# Altium project MLB_REV1.PrjPcb (part 2 of 3)

## Sheet SD_CARD_WiFi.SchDoc: =DocumentName
size B; SheetNumber: 3; SheetTotal: 8
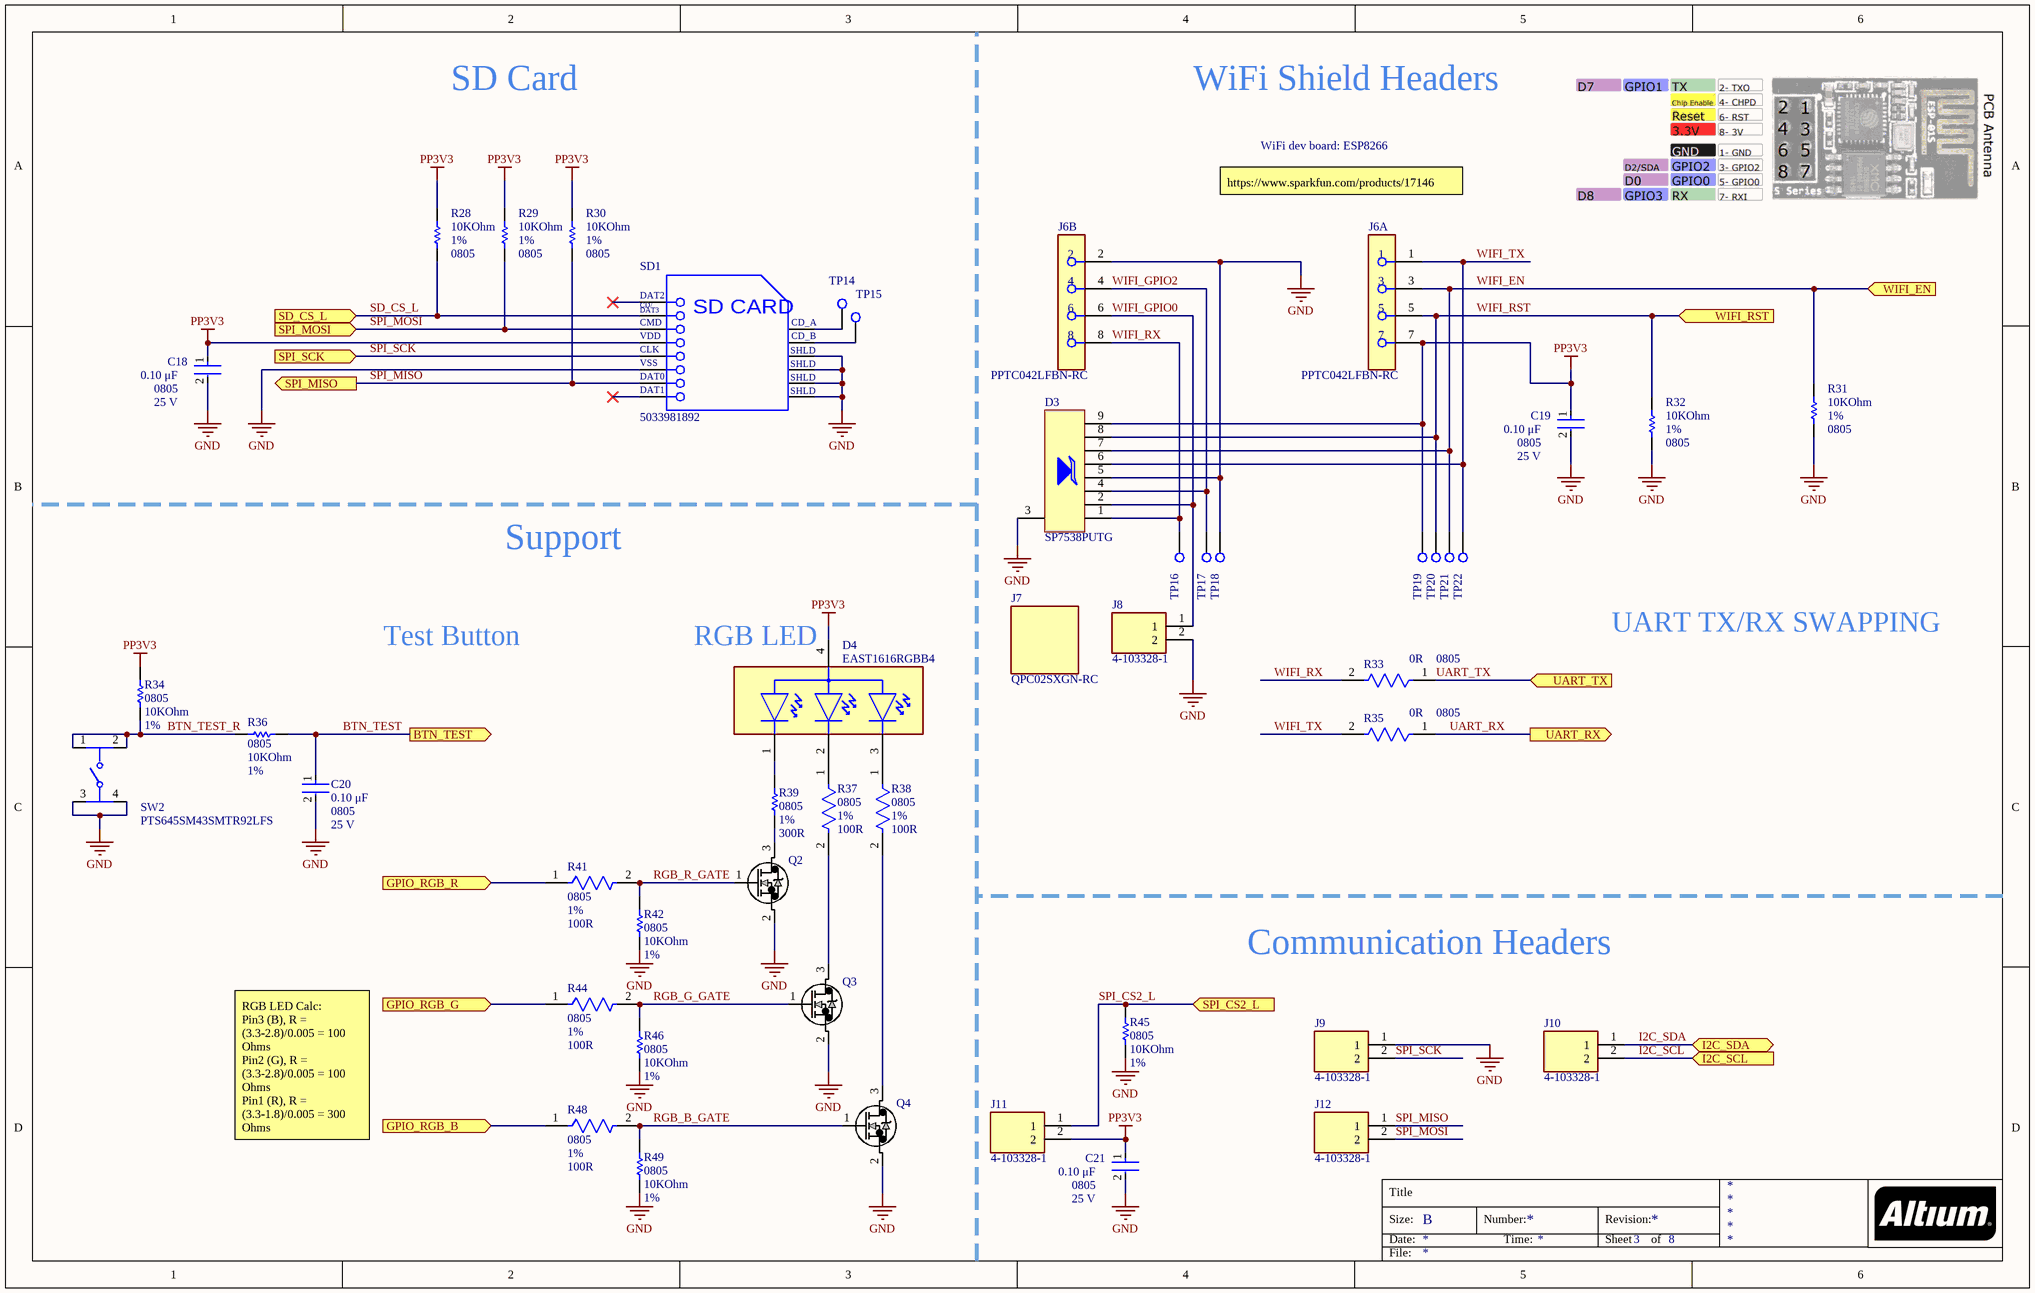
[diagram p2: SD_CARD_WiFi.SchDoc]

### Parts
(Parts that share a designator on the sheet are numbered #1, #2 ... from top to bottom, then left to right.)
C18  Capacitance: 0.10 μF  Package: 0805  Voltage Rating: 25 V  [FP-C0805C-DN-IPC_B]  (hidden comment: C0805C104M3RACTU)
C19  Capacitance: 0.10 μF  Package: 0805  Voltage Rating: 25 V  [FP-C0805C-DN-IPC_B]  (hidden comment: C0805C104M3RACTU)
C20  Capacitance: 0.10 μF  Package: 0805  Voltage Rating: 25 V  [FP-C0805C-DN-IPC_B]  (hidden comment: C0805C104M3RACTU)
C21  Capacitance: 0.10 μF  Package: 0805  Voltage Rating: 25 V  [FP-C0805C-DN-IPC_B]  (hidden comment: C0805C104M3RACTU)
D3  SP7538PUTG  [SP7538PUTG]
D4  EAST1616RGBB4  [FP-EAST1616RGBB4-MFG]
J6  PPTC042LFBN-RC  [FP-PPTC042LFBN-RC-MFG]  (parts A,B of 2)
J7  QPC02SXGN-RC  [FP-QPC02SXGN-RC-MFG]
J8  4-103328-1  [TE_4-103328-1]
J9  4-103328-1  [TE_4-103328-1]
J10  4-103328-1  [TE_4-103328-1]
J11#1  4-103328-1  [TE_4-103328-1]
J12#1  4-103328-1  [TE_4-103328-1]
Q2  RK7002BMT116  [TRANS_RK7002BMHZG_ROM]  (value not drawn)
Q3  RK7002BMT116  [TRANS_RK7002BMHZG_ROM]  (value not drawn)
Q4  RK7002BMT116  [TRANS_RK7002BMHZG_ROM]  (value not drawn)
R28  value 10KOhm  PackageReference: 0805  Tolerance: 1%  [RESC2013X60X35NL10T20]  (hidden comment: RC0805FR-0710KL)
R29  value 10KOhm  PackageReference: 0805  Tolerance: 1%  [RESC2013X60X35NL10T20]  (hidden comment: RC0805FR-0710KL)
R30  value 10KOhm  PackageReference: 0805  Tolerance: 1%  [RESC2013X60X35NL10T20]  (hidden comment: RC0805FR-0710KL)
R31  value 10KOhm  PackageReference: 0805  Tolerance: 1%  [RESC2013X60X35NL10T20]  (hidden comment: RC0805FR-0710KL)
R32  value 10KOhm  PackageReference: 0805  Tolerance: 1%  [RESC2013X60X35NL10T20]  (hidden comment: RC0805FR-0710KL)
R33  Case/Package: 0805  Resistance: 0R  [FP-RMCF0805-MFG]  (hidden comment: RMCF0805ZT0R00)
R34#2  value 10KOhm  PackageReference: 0805  Tolerance: 1%  [RESC2013X60X35NL10T20]  (hidden comment: RC0805FR-0710KL)
R35  Case/Package: 0805  Resistance: 0R  [FP-RMCF0805-MFG]  (hidden comment: RMCF0805ZT0R00)
R36  value 10KOhm  Package Reference: 0805  Tolerance: 1%  [RESC2013X50X30ML20T20]  (hidden comment: CRCW080515K0FKTA)
R37  Case Code (Imperial): 0805  Tolerance: 1%  Resistance: 100R  [FP-RMCF0805-IPC_A]  (hidden comment: RMCF0805FT100R)
R38  Case Code (Imperial): 0805  Tolerance: 1%  Resistance: 100R  [FP-RMCF0805-IPC_A]  (hidden comment: RMCF0805FT100R)
R39  PackageReference: 0805  Tolerance: 1%  Resistance: 300R  [RESC2013X70X40ML20T20]  (hidden comment: ERJ-6ENF3000V)
R41  Case Code (Imperial): 0805  Tolerance: 1%  Resistance: 100R  [FP-RMCF0805-IPC_A]  (hidden comment: RMCF0805FT100R)
R42  value 10KOhm  Package Reference: 0805  Tolerance: 1%  [RESC2013X50X30ML20T20]  (hidden comment: CRCW080515K0FKTA)
R44  Case Code (Imperial): 0805  Tolerance: 1%  Resistance: 100R  [FP-RMCF0805-IPC_A]  (hidden comment: RMCF0805FT100R)
R45  value 10KOhm  Package Reference: 0805  Tolerance: 1%  [RESC2013X50X30ML20T20]  (hidden comment: CRCW080515K0FKTA)
R46  value 10KOhm  Package Reference: 0805  Tolerance: 1%  [RESC2013X50X30ML20T20]  (hidden comment: CRCW080515K0FKTA)
R48  Case Code (Imperial): 0805  Tolerance: 1%  Resistance: 100R  [FP-RMCF0805-IPC_A]  (hidden comment: RMCF0805FT100R)
R49  value 10KOhm  Package Reference: 0805  Tolerance: 1%  [RESC2013X50X30ML20T20]  (hidden comment: CRCW080515K0FKTA)
SD1  5033981892  [MOLX-503398-1892_V]
SW2  PTS645SM43SMTR92LFS  [FP-PTS645SM43SMTR92LFS-MFG]
TP14  RCU-0C  [TP+195X110]  (value not drawn)
TP15#2  RCU-0C  [TP+195X110]  (value not drawn)
TP16  RCU-0C  [TP+195X110]  (value not drawn)
TP17  RCU-0C  [TP+195X110]  (value not drawn)
TP18  RCU-0C  [TP+195X110]  (value not drawn)
TP19  RCU-0C  [TP+195X110]  (value not drawn)
TP20  RCU-0C  [TP+195X110]  (value not drawn)
TP21  RCU-0C  [TP+195X110]  (value not drawn)
TP22  RCU-0C  [TP+195X110]  (value not drawn)

### Ports
BTN_TEST (out), GPIO_RGB_B (in), GPIO_RGB_G (in), GPIO_RGB_R (in), I2C_SCL (in), I2C_SDA (bidir), SD_CS_L (in), SPI_CS2_L (in), SPI_MISO (out), SPI_MOSI (in), SPI_SCK (in), UART_RX (out), UART_TX (in), WIFI_EN (in), WIFI_RST (in)

### Nets
GND: C18.2 C19.2 C20.2 C21.2 D3.3 D3.5 J6.2 J8.2 J9.1 Q2.2 Q3.2 Q4.2 R31.1 R32.1 R42.1 R45.1 R46.1 R49.1 SD1.6(VSS) SD1.11(SHLD) SD1.12(SHLD) SD1.13(SHLD) SD1.14(SHLD) SW2.3 SW2.4 TP18.1
PP3V3: C18.1 C19.1 C21.1 D3.9 D4.4(COMMON_ANODE) J6.7 J11#1.2 R28.2 R29.2 R30.2 R34#2.2 SD1.4(VDD) TP19.1
BTN_TEST: C20.1 R36.2 ; port BTN_TEST
BTN_TEST_R: R34#2.1 R36.1 SW2.1 SW2.2
GPIO_RGB_B: R48.1 ; port GPIO_RGB_B
GPIO_RGB_G: R44.1 ; port GPIO_RGB_G
GPIO_RGB_R: R41.1 ; port GPIO_RGB_R
I2C_SCL: J10.2 ; port I2C_SCL
I2C_SDA: J10.1 ; port I2C_SDA
RGB_B_GATE: Q4.1 R48.2 R49.2
RGB_G_GATE: Q3.1 R44.2 R46.2
RGB_R_GATE: Q2.1 R41.2 R42.2
SD_CS_L: R28.1 SD1.2(CD/DAT3) ; port SD_CS_L
SPI_CS2_L: J11#1.1 R45.2 ; port SPI_CS2_L
SPI_MISO: J12#1.1 R30.1 SD1.7(DAT0) ; port SPI_MISO
SPI_MOSI: J12#1.2 R29.1 SD1.3(CMD) ; port SPI_MOSI
SPI_SCK: J9.2 SD1.5(CLK) ; port SPI_SCK
UART_RX: R35.1 ; port UART_RX
UART_TX: R33.1 ; port UART_TX
WIFI_EN: D3.7 J6.3 R31.2 TP21.1 ; port WIFI_EN
WIFI_GPIO0: D3.2 J6.6 J8.1
WIFI_GPIO2: D3.4 J6.4 TP17.1
WIFI_RST: D3.8 J6.5 R32.2 TP20.1 ; port WIFI_RST
WIFI_RX: D3.1 J6.8 R33.2 TP16.1
WIFI_TX: D3.6 J6.1 R35.2 TP22.1
NetD4_1: D4.1(RED_C) R39.1
NetD4_2: D4.2(GREEN_C) R37.1
NetD4_3: D4.3(BLUE_C) R38.1
NetQ2_3: Q2.3 R39.2
NetQ3_3: Q3.3 R37.2
NetQ4_3: Q4.3 R38.2
NetSD1_9: SD1.9(CD_A) TP14.1
NetSD1_10: SD1.10(CD_B) TP15#2.1

Not connected (* = marked no-connect by the designer): SD1 1(DAT2)* 8(DAT1)*

### Notes on the sheet
- SD Card
- WiFi Shield Headers
- WiFi dev board: ESP8266
- https://www.sparkfun.com/products/17146
- Support
- UART TX/RX SWAPPING
- Test Button
- RGB LED
- Communication Headers
- RGB LED Calc:
  Pin3 (B), R = (3.3-2.8)/0.005 = 100 Ohms
  Pin2 (G), R = (3.3-2.8)/0.005 = 100 Ohms
  Pin1 (R), R = (3.3-1.8)/0.005 = 300 Ohms
- Title
- Size:
- Date:
- B
- Number:
- Time:
- Revision:
- Sheet
- of
- File:
- (in symbol 5033981892) CD/; DAT3; SD CARD

### Library data of the parts
C18-C21 = CMP-2007-00282-2: CAP CER 0.1UF 25V 20% X7R 0805; Manufacturer: KEMET; Temperature Coefficient: 30ppm/°C; Material: Ceramic; Tolerance: 0.2; Value: 0.10 μF; Digikey Description: CAP CER 0.1UF 25V 20% X7R 0805; Device Class L2: Capacitors; Temperature: -55°C to +125°C; Device Class L1: Passive Components; ComponentLink2Description: Datasheet; Mouser Description: Multilayer Ceramic Capacitors MLCC - SMD/SMT 25volts 0.1uF X7R 20%; Temperature Range High: +125°C; Device Class L3: Ceramic Capacitors; Automotive: No; Temperature Range Low: -55°C; RoHS: TRUE; Category: Cap; Lead Free: Yes; Ipc Land Pattern Name: CAPC200125X78; Height: 0.88mm; Temperature Characteristic: X7R; Octopart: https://octopart.com/c0805c104m3ractu-kemet-9138612; ComponentLink2URL: https://content.kemet.com/datasheets/KEM_C1003_C0G_SMD.pdf; Manufacturer Part Number: C0805C104M3RACTU; Supplier: Digi-Key; Supplier Part Number: 399-C0805C104M3RAC7800CT-ND
D3 = SP7538PUTG: ESD Suppressor TVS Octal Uni-Dir 25kV 9-Pin UDFN T/R; Manufacturer: Littelfuse; Number of Unidirectional Channels: 8; Reverse Standoff Voltage: 5V; Clamping Voltage: 7V; Peak Pulse Current: 2A; Power Line Protection: Yes; Supplier: Digi-Key; RoHS: Yes; Category: TVS Diodes; Stock 1: 40273; Pricing 1: 1=0.95000, 10=0.85200, 100=0.66410, 500=0.54862, 1000=0.43838 (USD); Mount: Surface Mount; Number of Pins: 9; Min Operating Temperature: -40°C; Max Operating Temperature: 150°C; Packaging: Cut Tape; RoHS Compliant: Yes; ComponentLink1URL: http://www.littelfuse.com/~/media/electronics/datasheets/tvs_diode_arrays/littelfuse_tvs_diode_array_sp7538p_datasheet.pdf.pdf?src-supplier=Farnell; ComponentLink1Description: http://www.littelfuse.com/~/media/electronics/datasheets/tvs_diode_arrays/littelfuse_tvs_diode_array_sp7538p_datasheet.pdf.pdf?src-supplier=Farnell; ComponentLink2URL: http://www.littelfuse.com/~/media/electronics/datasheets/tvs_diode_arrays/littelfuse_tvs_diode_array_sp7538p_datasheet.pdf.pdf?src-supplier=Digi-Key; ComponentLink2Description: http://www.littelfuse.com/~/media/electronics/datasheets/tvs_diode_arrays/littelfuse_tvs_diode_array_sp7538p_datasheet.pdf.pdf?src-supplier=Digi-Key; ComponentLink3URL: https://www.littelfuse.com/~/media/electronics/datasheets/tvs_diode_arrays/littelfuse_tvs_diode_array_sp7538p_datasheet.pdf.pdf?src-supplier=Digi-Key; ComponentLink3Description: https://www.littelfuse.com/~/media/electronics/datasheets/tvs_diode_arrays/littelfuse_tvs_diode_array_sp7538p_datasheet.pdf.pdf?src-supplier=Digi-Key; ComponentLink4URL: http://www.littelfuse.com/~/media/electronics/datasheets/tvs_diode_arrays/littelfuse_tvs_diode_array_sp7538p_datasheet.pdf.pdf?src-supplier=Arrow+Electronics; ComponentLink4Description: http://www.littelfuse.com/~/media/electronics/datasheets/tvs_diode_arrays/littelfuse_tvs_diode_array_sp7538p_datasheet.pdf.pdf?src-supplier=Arrow+Electronics; ComponentLink5URL: http://www.littelfuse.com/~/media/electronics/datasheets/tvs_diode_arrays/littelfuse_tvs_diode_array_sp7538p_datasheet.pdf.pdf?src-supplier=Mouser; ComponentLink5Description: http://www.littelfuse.com/~/media/electronics/datasheets/tvs_diode_arrays/littelfuse_tvs_diode_array_sp7538p_datasheet.pdf.pdf?src-supplier=Mouser; ComponentLink6URL: http://www.littelfuse.com/~/media/electronics/datasheets/tvs_diode_arrays/littelfuse_tvs_diode_array_sp7538p_datasheet.pdf.pdf?src-supplier=Verical; ComponentLink6Description: http://www.littelfuse.com/~/media/electronics/datasheets/tvs_diode_arrays/littelfuse_tvs_diode_array_sp7538p_datasheet.pdf.pdf?src-supplier=Verical; ComponentLink7URL: http://www.littelfuse.com/~/media/electronics/datasheets/tvs_diode_arrays/littelfuse_tvs_diode_array_sp7538p_datasheet.pdf.pdf?src-supplier=Newark; ComponentLink7Description: http://www.littelfuse.com/~/media/electronics/datasheets/tvs_diode_arrays/littelfuse_tvs_diode_array_sp7538p_datasheet.pdf.pdf?src-supplier=Newark; ComponentLink8URL: http://www.littelfuse.com/~/media/electronics/datasheets/tvs_diode_arrays/littelfuse_tvs_diode_array_sp7538p_datasheet.pdf.pdf?src-supplier=TTI; ComponentLink8Description: http://www.littelfuse.com/~/media/electronics/datasheets/tvs_diode_arrays/littelfuse_tvs_diode_array_sp7538p_datasheet.pdf.pdf?src-supplier=TTI; Supplier Part Number: F7417CT-ND; Manufacturer Part Number: SP7538PUTG
D4 = EAST1616RGBB4: LED RGB CLEAR 4SMD; Manufacturer: Everlight Electronics Co Ltd; Element Configuration: Common Anode; Test Current: 5mA; Lens Color: Colorless; Lens Size: 1.1mm; Viewing Angle: 120°; Color: Blue; Lens Style: Flat; Forward Voltage: 2.8V; Mount: Surface Mount; Length: 1.6mm; Packaging: Tape and Reel; Case/Package: 0606; Lens Transparency: Clear; Case Code (Metric): 1616; Width: 1.6mm; Height: 0.45mm; Case Code (Imperial): 0606; Manufacturer Part Number: EAST1616RGBB4; Supplier: Digi-Key; Supplier Part Number: 1080-1552-1-ND
J6 = PPTC042LFBN-RC: CONN HDR 8POS 0.1 TIN PCB; Manufacturer: Sullins Connector Solutions; Is Female: yes; Conn Orientation: Straight; Conn Gender: Female; Number Of Contacts: 8; Pitch: 2.54mm; Voltage Rating: 250V; Current Rating: 3A; Package: PPTC042LFBN-RC; Number Of Rows: 2; Manufacturer Part Number: PPTC042LFBN-RC; Contact Material: Tin,Nickel; Temperature: -40°C to +105°C; Height: 8.65mm; Device Class L2: Headers and Wire Housings; Octopart: https://octopart.com/pptc042lfbn-rc-sullins-271088; RoHS: TRUE; ComponentLink2URL: https://drawings-pdf.s3.amazonaws.com/10492.pdf; Lead Free: Yes; Automotive: No; Device Class L3: unset; ComponentLink2Description: Datasheet; Temperature Range High: +105°C; Digikey Description: CONN HDR 8POS 0.1 TIN PCB; Category: Conn; Device Class L1: Connectors; Temperature Range Low: -40°C; Supplier: Digi-Key; Supplier Part Number: S7072-ND
J7 = CMP-25666-000001-1: CONN JUMPER SHORTING .100" GOLD; Manufacturer: Sullins; Conn Orientation: Straight; Pitch: 2.54mm; Current Rating: 3A; Number Of Contacts: 2; Category: Conn; Temperature Range Low: -40°C; Temperature Range High: +85°C; Device Class L1: Connectors; Lead Free: Yes; Manufacturer Part Number: QPC02SXGN-RC; Automotive: No; Height: 6.17mm; ComponentLink2URL: https://s3.amazonaws.com/catalogspreads-pdf/PAGE128-129%20.100%20JUMPER.pdf; Device Class L2: unset; Footprint Url: https://drawings-pdf.s3.amazonaws.com/11510.pdf; Device Class L3: unset; Temperature: -40°C to +85°C; RoHS: TRUE; Digikey Description: CONN JUMPER SHORTING .100" GOLD; Octopart: https://octopart.com/qpc02sxgn-rc-sullins-19878795; Package: 0; ComponentLink2Description: Datasheet; Contact Material: Gold; Supplier: Digi-Key; Supplier Part Number: S9337-ND
J8-J10 J11#1 J12#1 = 4-103328-1: Connector Header Through Hole 2 position; Manufacturer: TE Connectivity AMP Connectors; MF: TE Connectivity; SnapEDA_Link: https://www.snapeda.com/parts/4-103328-1/TE%20Connectivity%20AMP%20Connectors/view-part/2384420/?ref=snap; MP: 4-103328-1; TE_purchase_URL: https://www.te.com/usa-en/product-4-103328-1.html?te_bu=Cor&te_type=disp&te_campaign=seda_glo_cor-seda-global-disp-prtnr-fy19-seda-model-bom-cta_sma-317_1&elqCampaignId=32493; Availability: Unavailable; Value: *; EU_RoHS_Compliance: Compliant; Price: None; Package: None; Supplier: Digi-Key; Supplier Part Number: A121364-ND; Manufacturer Part Number: 4-103328-1
Q2-Q4 = RK7002BMT116: No Description Available; Mfr_Name: ROHM Semiconductor; Type: DEV; Copyright: Copyright (C) 2022 Ultra Librarian. All rights reserved.; Digi-Key_Part_Number_1: RK7002BMT116CT-ND; Digi-Key_Part_Number_2: RK7002BMT116DKR-ND; Digi-Key_Part_Number_3: RK7002BMT116TR-ND; RefDes: RefDes; Manufacturer_Part_Number: RK7002BMT116; Manufacturer: Rohm Semiconductor; Manufacturer Part Number: RK7002BMT116; Supplier: Digi-Key; Supplier Part Number: RK7002BMT116CT-ND
R28-R32 R34#2 = CMP-1659-00013-4: Chip Resistor, 10 KOhm, +/- 1%, 0.125 W, -55 to 155 degC, 0805 (2012 Metric), RoHS, Tape and Reel; Manufacturer: Yageo; Voltage Rating: 150 V; Mount: Surface Mount; ComponentLink1Description: Manufacturer URL; ComponentLink2URL: http://www.yageo.com/documents/recent/PYu-RC_Group_51_RoHS_L_04.pdf; Pins: 2; Length: 2 mm; Min Operating Temperature: -55 degC; Height: 0.5 mm; Mounting Technology: Surface Mount; RoHSCompliant: true; REACH SVHC: No SVHC; ComponentLink1URL: http://www.yageo.com/; Max Operating Temperature: 155 degC; DatasheetVersion: Rev. 4, 02/2016; Package Quantity: 5000; Packaging: Tape and Reel; ComponentLink2Description: Datasheet; PackageDescription: 2-Pin Surface Mounted Device, Body 2 x 1.25 mm; Manufacturer Part Number: RC0805FR-0710KL; Supplier: Digi-Key; Supplier Part Number: RC0805FR-0710KL
R33 R35 = CMP-26527-000017-1: RES 0 OHM JUMPER 1/8W 0805; Manufacturer: Stackpole Electronics Inc; Power Rating: 125mW; Depth: 1.25mm; Length: 2mm; Military Standard: Not; Width: 0.049inch; Case Code (Imperial): 0805; Number of Terminations: 2; Mount: Surface Mount; Contact Plating: Tin; Height: 0.026inch; Min Operating Temperature: -55°C; Composition: Thick Film; Max Operating Temperature: 155°C; Packaging: Tape and Reel; Features: Automotive AEC-Q200; Max Power Dissipation: 125mW; Radiation Hardening: No; Lead Free: Lead Free; Case Code (Metric): 2012; Supplier: Digi-Key; Supplier Part Number: RMCF0805ZT0R00CT-ND; Manufacturer Part Number: RMCF0805ZT0R00
R36 R42 R45 R46 R49 = CMP-2001-04968-1: Manufacturer: Vishay Dale; Manufacturer Part Number: CRCW080515K0FKTA; Supplier: Digi-Key; Supplier Part Number: 541-3019-1-ND
R37 R38 R41 R44 R48 = CMP-26527-001731-1: 100Ω ±1% 0.125W 0805 Thick Film Chip Resistor AEC-Q200 compliant; Manufacturer: Stackpole Electronics Inc; Power Rating: 250mW; Temperature Coefficient: 100ppm/°C; Max Power Dissipation: 125mW; Radiation Hardening: No; RoHS Compliant: Yes; Depth: 1.25mm; Length: 2mm; Min Operating Temperature: -55°C; Series: RMCF; Packaging: Tape and Reel; Features: Automotive AEC-Q200; Height: 0.026inch; Size Code: 0805; Number of Terminations: 2; Max Operating Temperature: 155°C; Case/Package: 0805; Width: 0.049inch; Contact Plating: Tin; Resistor Type: Thick Film; Construction: Rectangular; Lead Free: Lead Free; Military Standard: Not; Case Code (Metric): 2012; Mount: Surface Mount; Manufacturer Part Number: RMCF0805FT100R; Supplier: Digi-Key; Supplier Part Number: RMCF0805FT100RCT-ND
R39 = CMP-2001-00110-5: Chip Resistor, 300 Ohm, +/- 1%, 0.125 W, -55 to 155 degC, 0805 (2012 Metric), RoHS, Tape and Reel; Manufacturer: Panasonic; Voltage Rating: 150 V; Package Quantity: 5000; PackageDescription: 2-Pin Surface Mount Device, Body 2 x 1.25 mm; Mounting Technology: Surface Mount; ComponentLink2URL: http://industrial.panasonic.com/cdbs/www-data/pdf/RDA0000/AOA0000C86.pdf; DatasheetVersion: 04/2015; ComponentLink1URL: http://www.panasonic.com/; Mount: Surface Mount; ComponentLink1Description: Manufacturer URL; RoHSCompliant: true; Min Operating Temperature: -55 degC; Height: 0.6 mm; ComponentLink2Description: Datasheet; Max Operating Temperature: 155 degC; Length: 2 mm; Packaging: Tape and Reel; REACH SVHC: Yes; Manufacturer Part Number: ERJ-6ENF3000V; Supplier: Digi-Key; Supplier Part Number: P300CCT-ND
SD1 = 5033981892: Micro SD Connector, Pitch 1.1 mm, 8 Position, Height 1.4 mm, -25 to 85 degC, RoHS, Tape and Reel; Manufacturer: Molex; Voltage Rating: 10VAC/DC; Current Rating: 500mA; Manufacturer URL: http://www.molex.com/; Package Reference: 503398-1892; Packaging: Reel; RoHS: Details; Brand: Molex; Datasheet URL: http://www.molex.com/pdm_docs/sd/5033981892_sd.pdf; Mounting Technology: SurfaceMount; Factory Pack Quantity: 2400; Datasheet Version: Rev. E, 04/2006; Series: 503398; Product Category: MemoryCardConnectors; Package Description: Micro SD Connector, Pitch 1.1 mm, 8 Position, Height 1.4 mm; Supplier: Digi-Key; Supplier Part Number: WM11190CT-ND; Manufacturer Part Number: 5033981892
SW2 = PTS645SM43SMTR92_LFS: SWITCH TACTILE SPST-NO 0.05A 12V; Manufacturer: C&K; Contact Resistance: 100mR; Throw Configuration: SPST; Illumination Type: Non-Illuminated; Mechanical Life: 100000Cycles; Current Rating: 50mA; Switch Function: Off-Mom; Actuator Length: 0.85mm; Actuator Material: Nylon; Actuator Type: Standard; Operating Force: 160gf; Min Operating Temperature: -20°C; REACH SVHC: No SVHC; Termination: Gull Wing; Case/Package: SMD/SMT; Packaging: Tape and Reel; Mount: Surface Mount; Voltage Rating (DC): 12V; Orientation: Straight; Lead Free: Lead Free; Contact Material: Silver; Color: Black; Max Current Rating: 50mA; Contact Plating: Silver; Depth: 9mm; Package Quantity: 1; Max Voltage Rating (DC): 12V; Length: 6mm; Max Operating Temperature: 60°C; Manufacturer Part Number: PTS645SM43SMTR92 LFS; Supplier: Digi-Key; Supplier Part Number: CKN9112CT-ND
TP14 TP15#2 TP16-TP22 = RCU-0C: Natural PC Test Point , Plating Surface Mount Mounting Type; Manufacturer: TE Connectivity AMP Connectors; Value: *; Package: SON-6 TE Connectivity AMP Connectors; Purchase-URL: https://pricing.snapeda.com/search/part/RCU-0C/?ref=eda; Supplier Part Number: A106145CT-ND; Check_prices: https://www.snapeda.com/parts/RCU-0C/TE%20Connectivity/view-part/4791537/?ref=eda; Manufacturer Part Number: RCU-0C; SnapEDA_Link: https://www.snapeda.com/parts/RCU-0C/TE%20Connectivity/view-part/4791537/?ref=snap; Supplier: Digi-Key

## Sheet POWER_MUXES.SchDoc: =DocumentName
size C; SheetNumber: 4; SheetTotal: 8
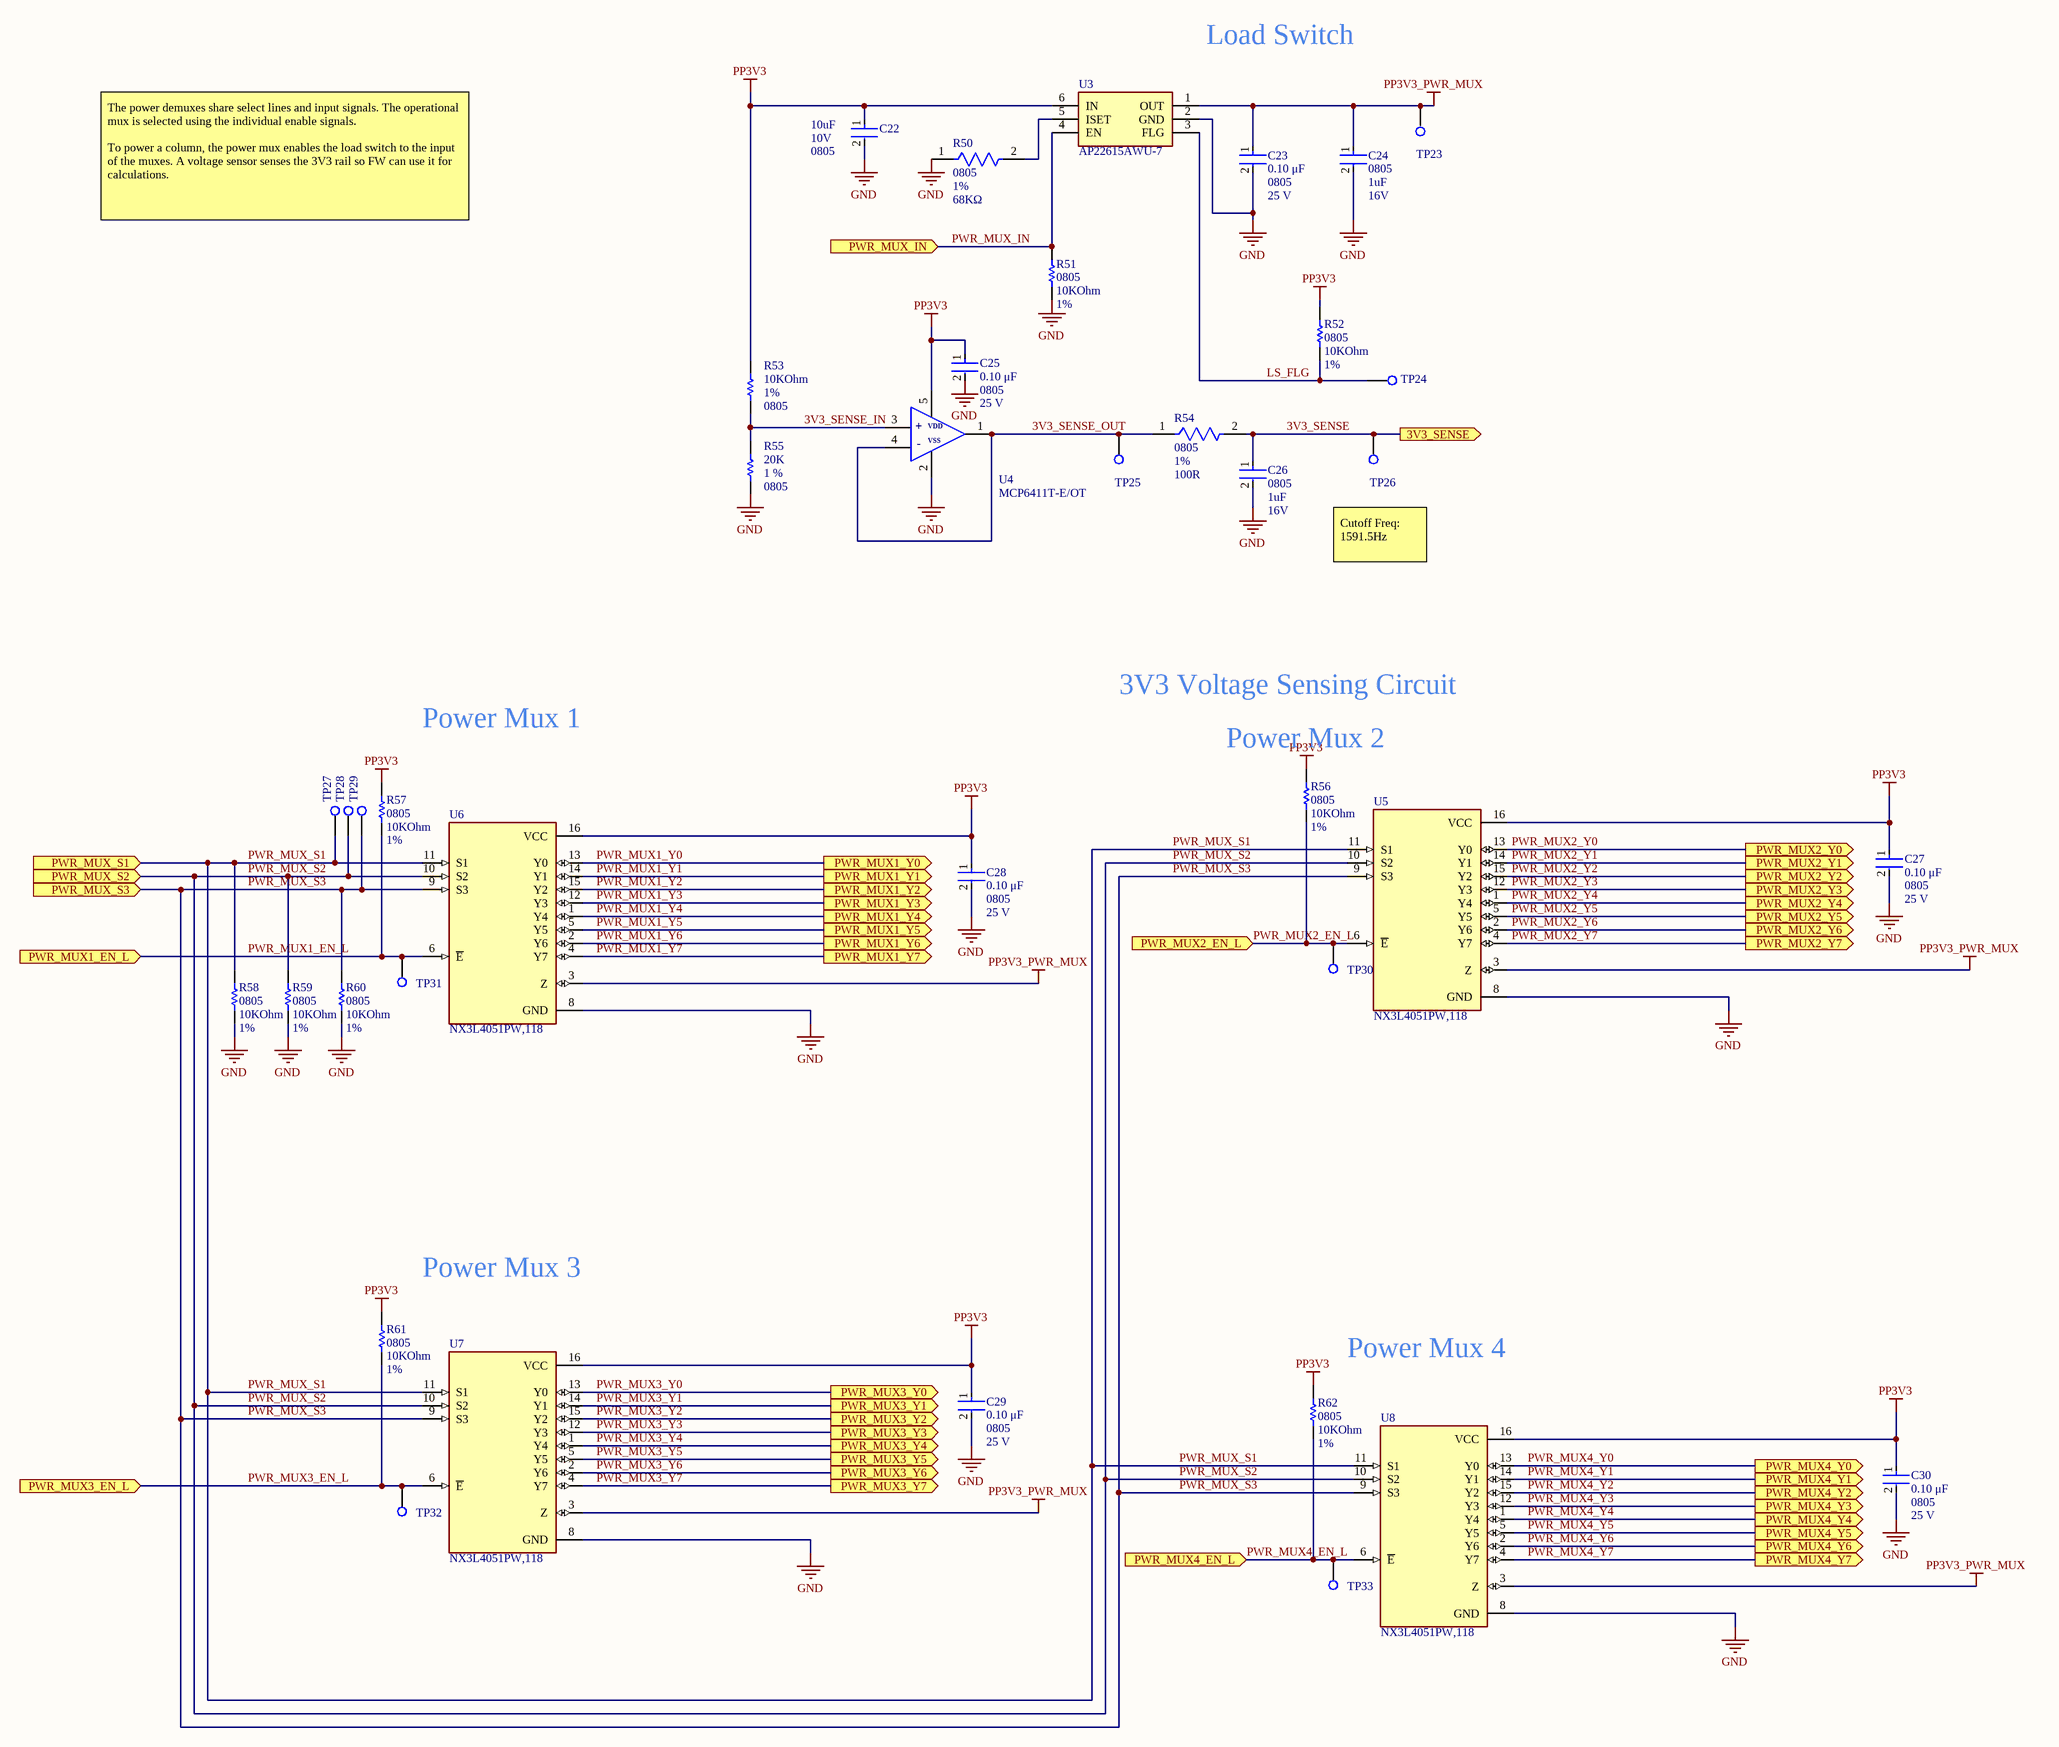
[diagram p3: POWER_MUXES.SchDoc]

### Parts
(Parts that share a designator on the sheet are numbered #1, #2 ... from top to bottom, then left to right.)
C22  Case/Package: 0805  Voltage Rating (DC): 10V  Capacitance: 10uF  [FP-GRM21B-0_15-IPC_A]  (hidden comment: GRM21BR71A106KA73K)
C23  Capacitance: 0.10 μF  Package: 0805  Voltage Rating: 25 V  [FP-C0805C-DN-IPC_B]  (hidden comment: C0805C104M3RACTU)
C24  Case/Package: 0805  Capacitance: 1uF  Voltage: 16V  [FP-CL21-IPC_A]  (hidden comment: CL21B105KOFNNNE)
C25  Capacitance: 0.10 μF  Package: 0805  Voltage Rating: 25 V  [FP-C0805C-DN-IPC_B]  (hidden comment: C0805C104M3RACTU)
C26  Case/Package: 0805  Capacitance: 1uF  Voltage: 16V  [FP-CL21-IPC_A]  (hidden comment: CL21B105KOFNNNE)
C27  Capacitance: 0.10 μF  Package: 0805  Voltage Rating: 25 V  [FP-C0805C-DN-IPC_B]  (hidden comment: C0805C104M3RACTU)
C28  Capacitance: 0.10 μF  Package: 0805  Voltage Rating: 25 V  [FP-C0805C-DN-IPC_B]  (hidden comment: C0805C104M3RACTU)
C29  Capacitance: 0.10 μF  Package: 0805  Voltage Rating: 25 V  [FP-C0805C-DN-IPC_B]  (hidden comment: C0805C104M3RACTU)
C30  Capacitance: 0.10 μF  Package: 0805  Voltage Rating: 25 V  [FP-C0805C-DN-IPC_B]  (hidden comment: C0805C104M3RACTU)
R50  Package Reference: 0805  Tolerance: 1%  Resistance: 68KΩ  [FP-CRGCQ0805-IPC_C]  (hidden comment: CRGCQ0805F68K)
R51  value 10KOhm  Package Reference: 0805  Tolerance: 1%  [RESC2013X50X30ML20T20]  (hidden comment: CRCW080515K0FKTA)
R52  value 10KOhm  Package Reference: 0805  Tolerance: 1%  [RESC2013X50X30ML20T20]  (hidden comment: CRCW080515K0FKTA)
R53  value 10KOhm  PackageReference: 0805  Tolerance: 1%  [RESC2013X60X35NL10T20]  (hidden comment: RC0805FR-0710KL)
R54  Case Code (Imperial): 0805  Tolerance: 1%  Resistance: 100R  [FP-RMCF0805-IPC_A]  (hidden comment: RMCF0805FT100R)
R55  value 20K  Tolerance: 1 %  Case-EIA: 0805  [RESC0805(2012)_N]  (hidden comment: 20K 1% 0805(2012))
R56  value 10KOhm  Package Reference: 0805  Tolerance: 1%  [RESC2013X50X30ML20T20]  (hidden comment: CRCW080515K0FKTA)
R57#1  value 10KOhm  Package Reference: 0805  Tolerance: 1%  [RESC2013X50X30ML20T20]  (hidden comment: CRCW080515K0FKTA)
R58  value 10KOhm  Package Reference: 0805  Tolerance: 1%  [RESC2013X50X30ML20T20]  (hidden comment: CRCW080515K0FKTA)
R59  value 10KOhm  Package Reference: 0805  Tolerance: 1%  [RESC2013X50X30ML20T20]  (hidden comment: CRCW080515K0FKTA)
R60#1  value 10KOhm  Package Reference: 0805  Tolerance: 1%  [RESC2013X50X30ML20T20]  (hidden comment: CRCW080515K0FKTA)
R61  value 10KOhm  Package Reference: 0805  Tolerance: 1%  [RESC2013X50X30ML20T20]  (hidden comment: CRCW080515K0FKTA)
R62  value 10KOhm  Package Reference: 0805  Tolerance: 1%  [RESC2013X50X30ML20T20]  (hidden comment: CRCW080515K0FKTA)
TP23  RCU-0C  [TP+195X110]  (value not drawn)
TP24  RCU-0C  [TP+195X110]  (value not drawn)
TP25  RCU-0C  [TP+195X110]  (value not drawn)
TP26  RCU-0C  [TP+195X110]  (value not drawn)
TP27  RCU-0C  [TP+195X110]  (value not drawn)
TP28  RCU-0C  [TP+195X110]  (value not drawn)
TP29  RCU-0C  [TP+195X110]  (value not drawn)
TP30  RCU-0C  [TP+195X110]  (value not drawn)
TP31  RCU-0C  [TP+195X110]  (value not drawn)
TP32  RCU-0C  [TP+195X110]  (value not drawn)
TP33  RCU-0C  [TP+195X110]  (value not drawn)
U3  AP22615AWU-7  [SOT95P280X100-6N]
U4  MCP6411T-E/OT  [SOT95P280X145-5N]
U5  NX3L4051PW,118  [SOP65P640X110-16N - duplicate]
U6  NX3L4051PW,118  [SOP65P640X110-16N - duplicate]
U7  NX3L4051PW,118  [SOP65P640X110-16N - duplicate]
U8  NX3L4051PW,118  [SOP65P640X110-16N - duplicate]

### Ports
3V3_SENSE (out), PWR_MUX1_EN_L (in), PWR_MUX1_Y0 (out), PWR_MUX1_Y1 (out), PWR_MUX1_Y2 (out), PWR_MUX1_Y3 (out), PWR_MUX1_Y4 (out), PWR_MUX1_Y5 (out), PWR_MUX1_Y6 (out), PWR_MUX1_Y7 (out), PWR_MUX2_EN_L (in), PWR_MUX2_Y0 (out), PWR_MUX2_Y1 (out), PWR_MUX2_Y2 (out), PWR_MUX2_Y3 (out), PWR_MUX2_Y4 (out), PWR_MUX2_Y5 (out), PWR_MUX2_Y6 (out), PWR_MUX2_Y7 (out), PWR_MUX3_EN_L (in), PWR_MUX3_Y0 (out), PWR_MUX3_Y1 (out), PWR_MUX3_Y2 (out), PWR_MUX3_Y3 (out), PWR_MUX3_Y4 (out), PWR_MUX3_Y5 (out), PWR_MUX3_Y6 (out), PWR_MUX3_Y7 (out), PWR_MUX4_EN_L (in), PWR_MUX4_Y0 (out), PWR_MUX4_Y1 (out), PWR_MUX4_Y2 (out), PWR_MUX4_Y3 (out), PWR_MUX4_Y4 (out), PWR_MUX4_Y5 (out), PWR_MUX4_Y6 (out), PWR_MUX4_Y7 (out), PWR_MUX_IN (in), PWR_MUX_S1 (in), PWR_MUX_S2 (in), PWR_MUX_S3 (in)

### Nets
GND: C22.2 C23.2 C24.2 C25.2 C26.2 C27.2 C28.2 C29.2 C30.2 R50.1 R51.2 R55.1 R58.1 R59.1 R60#1.1 U3.2(GND) U4.2(VSS) U5.8(GND) U6.8(GND) U7.8(GND) U8.8(GND)
PP3V3: C22.1 C25.1 C27.1 C28.1 C29.1 C30.1 R52.1 R53.2 R56.2 R57#1.2 R61.2 R62.2 U3.6(IN) U4.5(VDD) U5.16(VCC) U6.16(VCC) U7.16(VCC) U8.16(VCC)
PP3V3_PWR_MUX: C23.1 C24.1 TP23.1 U3.1(OUT) U5.3(Z) U6.3(Z) U7.3(Z) U8.3(Z)
3V3_SENSE: C26.1 R54.2 TP26.1 ; port 3V3_SENSE
3V3_SENSE_IN: R53.1 R55.2 U4.3(VIN+)
3V3_SENSE_OUT: R54.1 TP25.1 U4.1(VOUT) U4.4(VIN-)
LS_FLG: R52.2 TP24.1 U3.3(FLG)
PWR_MUX1_EN_L: R57#1.1 TP31.1 U6.6(~{E}) ; port PWR_MUX1_EN_L
PWR_MUX1_Y0: U6.13(Y0) ; port PWR_MUX1_Y0
PWR_MUX1_Y1: U6.14(Y1) ; port PWR_MUX1_Y1
PWR_MUX1_Y2: U6.15(Y2) ; port PWR_MUX1_Y2
PWR_MUX1_Y3: U6.12(Y3) ; port PWR_MUX1_Y3
PWR_MUX1_Y4: U6.1(Y4) ; port PWR_MUX1_Y4
PWR_MUX1_Y5: U6.5(Y5) ; port PWR_MUX1_Y5
PWR_MUX1_Y6: U6.2(Y6) ; port PWR_MUX1_Y6
PWR_MUX1_Y7: U6.4(Y7) ; port PWR_MUX1_Y7
PWR_MUX2_EN_L: R56.1 TP30.1 U5.6(~{E}) ; port PWR_MUX2_EN_L
PWR_MUX2_Y0: U5.13(Y0) ; port PWR_MUX2_Y0
PWR_MUX2_Y1: U5.14(Y1) ; port PWR_MUX2_Y1
PWR_MUX2_Y2: U5.15(Y2) ; port PWR_MUX2_Y2
PWR_MUX2_Y3: U5.12(Y3) ; port PWR_MUX2_Y3
PWR_MUX2_Y4: U5.1(Y4) ; port PWR_MUX2_Y4
PWR_MUX2_Y5: U5.5(Y5) ; port PWR_MUX2_Y5
PWR_MUX2_Y6: U5.2(Y6) ; port PWR_MUX2_Y6
PWR_MUX2_Y7: U5.4(Y7) ; port PWR_MUX2_Y7
PWR_MUX3_EN_L: R61.1 TP32.1 U7.6(~{E}) ; port PWR_MUX3_EN_L
PWR_MUX3_Y0: U7.13(Y0) ; port PWR_MUX3_Y0
PWR_MUX3_Y1: U7.14(Y1) ; port PWR_MUX3_Y1
PWR_MUX3_Y2: U7.15(Y2) ; port PWR_MUX3_Y2
PWR_MUX3_Y3: U7.12(Y3) ; port PWR_MUX3_Y3
PWR_MUX3_Y4: U7.1(Y4) ; port PWR_MUX3_Y4
PWR_MUX3_Y5: U7.5(Y5) ; port PWR_MUX3_Y5
PWR_MUX3_Y6: U7.2(Y6) ; port PWR_MUX3_Y6
PWR_MUX3_Y7: U7.4(Y7) ; port PWR_MUX3_Y7
PWR_MUX4_EN_L: R62.1 TP33.1 U8.6(~{E}) ; port PWR_MUX4_EN_L
PWR_MUX4_Y0: U8.13(Y0) ; port PWR_MUX4_Y0
PWR_MUX4_Y1: U8.14(Y1) ; port PWR_MUX4_Y1
PWR_MUX4_Y2: U8.15(Y2) ; port PWR_MUX4_Y2
PWR_MUX4_Y3: U8.12(Y3) ; port PWR_MUX4_Y3
PWR_MUX4_Y4: U8.1(Y4) ; port PWR_MUX4_Y4
PWR_MUX4_Y5: U8.5(Y5) ; port PWR_MUX4_Y5
PWR_MUX4_Y6: U8.2(Y6) ; port PWR_MUX4_Y6
PWR_MUX4_Y7: U8.4(Y7) ; port PWR_MUX4_Y7
PWR_MUX_IN: R51.1 U3.4(EN) ; port PWR_MUX_IN
PWR_MUX_S1: R58.2 TP27.1 U5.11(S1) U6.11(S1) U7.11(S1) U8.11(S1) ; port PWR_MUX_S1
PWR_MUX_S2: R59.2 TP28.1 U5.10(S2) U6.10(S2) U7.10(S2) U8.10(S2) ; port PWR_MUX_S2
PWR_MUX_S3: R60#1.2 TP29.1 U5.9(S3) U6.9(S3) U7.9(S3) U8.9(S3) ; port PWR_MUX_S3
NetR50_2: R50.2 U3.5(ISET)

### Notes on the sheet
- Load Switch
- The power demuxes share select lines and input signals. The operational mux is selected using the individual enable signals.
  To power a column, the power mux enables the load switch to the input of the muxes. A voltage sensor senses the 3V3 rail so FW can use it for calculations.
- Cutoff Freq: 1591.5Hz
- 3V3 Voltage Sensing Circuit
- Power Mux 1
- Power Mux 2
- (near R61) Power Mux 3
- (near R62) Power Mux 4
- Title
- Size:
- Date:
- File:
- C
- Number:
- Time:
- Revision:
- Sheet
- of
- (in symbol MCP6411T-E_OT) +; -

### Library data of the parts
C22 = CMP-06035-038134-1: Chip Multilayer Ceramic Capacitors for General Purpose, 0805, 10uF, X7R, 15%, 10%, 10V; Manufacturer: Murata Electronics; Dielectric: X7R; Thickness: 1.25mm; Tolerance: 10%; Length: 2mm; Width: 1.25mm; Manufacturer Part Number: GRM21BR71A106KA73K; Supplier Part Number: 490-14381-1-ND; Supplier: Digi-Key
C23 C25 C27-C30 = CMP-2007-00282-2: as C18 on sheet SD_CARD_WiFi; Digikey Description: CAP CER 0.1UF 25V 20% X7R 0805; Device Class L2: Capacitors; Temperature: -55°C to +125°C; Device Class L1: Passive Components; ComponentLink2Description: Datasheet; Mouser Description: Multilayer Ceramic Capacitors MLCC - SMD/SMT 25volts 0.1uF X7R 20%; Temperature Range High: +125°C; Device Class L3: Ceramic Capacitors; Automotive: No; Temperature Range Low: -55°C; RoHS: TRUE; Category: Cap; Lead Free: Yes; Ipc Land Pattern Name: CAPC200125X78; Height: 0.88mm; Temperature Characteristic: X7R; Octopart: https://octopart.com/c0805c104m3ractu-kemet-9138612; ComponentLink2URL: https://content.kemet.com/datasheets/KEM_C1003_C0G_SMD.pdf; Manufacturer Part Number: C0805C104M3RACTU; Supplier: Digi-Key; Supplier Part Number: 399-C0805C104M3RAC7800CT-ND
C24 C26 = CMP-13271-003098-1: CL21 Series 0805 1uF 16V ±10% Tolerance X7R Multilayer Ceramic Chip Capacitor; Manufacturer: Samsung Electro-Mechanics; Width: 0.049inch; Thickness: 0.053inch; Voltage Rating: 16V; Max Operating Temperature: 125°C; Case Code (Imperial): 0805; Height: 1.25mm; Length: 2mm; Lead Free: Lead Free; Mount: Surface Mount; Tolerance: 10%; Voltage Rating (DC): 16V; Min Operating Temperature: -55°C; Contact Plating: Tin; Depth: 1.25mm; Packaging: Tape and Reel; Package Quantity: 1; Dielectric: X7R; Radiation Hardening: No; Case Code (Metric): 2012; Manufacturer Part Number: CL21B105KOFNNNE; Supplier: Digi-Key; Supplier Part Number: 1276-1026-1-ND
R50 = CMP-03211-004185-1: CRGCQ0805 68KΩ 0.125W ±100ppm/°C 1% 150V; Manufacturer: TE Connectivity Passive Product; Temperature Coefficient: ±100ppm/°C; Height: 0.65mm; Composition: Thick Film; Package: CRGCQ0805; Temperature Range High: +155°C; ComponentLink2Description: Datasheet; Device Class L3: Chip SMD Resistors; Ipc Land Pattern Name: RESC200125X55; Temperature Range Low: -55°C; Category: Res; Automotive: Yes; Ambient Temperature Range High: +70°C; Power Rating: 0.125W; Octopart: https://octopart.com/crgcq0805f68k-te+connectivity-91018191; Lead Free: Yes; RoHS: TRUE; Automotive Grade: Grade 1103; Device Class L1: Passive Components; Voltage Rating: 150V; ComponentLink2URL: https://www.te.com/commerce/DocumentDelivery/DDEController?Action=showdoc&DocId=Data+Sheet%7F1773204-3%7F1%7Fpdf%7FEnglish%7FENG_DS_1773204-3_1.pdf%7F4-2176341-1112; Series: CRGCQ; Temperature: -55°C to +155°C; Manufacturer Part Number: CRGCQ0805F68K; Device Class L2: Resistors; Value: 68KΩ; Supplier: Digi-Key; Supplier Part Number: A129771CT-ND
R51 R52 R56 R57#1 R58 R59 R60#1 R61 R62 = CMP-2001-04968-1: Manufacturer: Vishay Dale; Manufacturer Part Number: CRCW080515K0FKTA; Supplier: Digi-Key; Supplier Part Number: 541-3019-1-ND
R53 = CMP-1659-00013-4: as R28 on sheet SD_CARD_WiFi; Mount: Surface Mount; ComponentLink1Description: Manufacturer URL; ComponentLink2URL: http://www.yageo.com/documents/recent/PYu-RC_Group_51_RoHS_L_04.pdf; Pins: 2; Length: 2 mm; Min Operating Temperature: -55 degC; Height: 0.5 mm; Mounting Technology: Surface Mount; RoHSCompliant: true; REACH SVHC: No SVHC; ComponentLink1URL: http://www.yageo.com/; Max Operating Temperature: 155 degC; DatasheetVersion: Rev. 4, 02/2016; Package Quantity: 5000; Packaging: Tape and Reel; ComponentLink2Description: Datasheet; PackageDescription: 2-Pin Surface Mounted Device, Body 2 x 1.25 mm; Manufacturer Part Number: RC0805FR-0710KL; Supplier: Digi-Key; Supplier Part Number: RC0805FR-0710KL
R54 = CMP-26527-001731-1: as R37 on sheet SD_CARD_WiFi; Radiation Hardening: No; RoHS Compliant: Yes; Depth: 1.25mm; Length: 2mm; Min Operating Temperature: -55°C; Series: RMCF; Packaging: Tape and Reel; Features: Automotive AEC-Q200; Height: 0.026inch; Size Code: 0805; Number of Terminations: 2; Max Operating Temperature: 155°C; Case/Package: 0805; Width: 0.049inch; Contact Plating: Tin; Resistor Type: Thick Film; Construction: Rectangular; Lead Free: Lead Free; Military Standard: Not; Case Code (Metric): 2012; Mount: Surface Mount; Manufacturer Part Number: RMCF0805FT100R; Supplier: Digi-Key; Supplier Part Number: RMCF0805FT100RCT-ND
R55 = CMP-1013-00655-1: 20K 0.125W 1% 0805 (2012 Metric)  SMD; Manufacturer Part Number: RC0805FR-0720KL; Manufacturer: YAGEO; Case-Metric: 2012; Power: 0.125 W; Technology: SMT; Supplier: Digi-Key; Supplier Part Number: 311-20.0KCRCT-ND
TP23-TP33 = RCU-0C: as TP14 on sheet SD_CARD_WiFi; Value: *; Package: SON-6 TE Connectivity AMP Connectors; Purchase-URL: https://pricing.snapeda.com/search/part/RCU-0C/?ref=eda; Supplier Part Number: A106145CT-ND; Check_prices: https://www.snapeda.com/parts/RCU-0C/TE%20Connectivity/view-part/4791537/?ref=eda; Manufacturer Part Number: RCU-0C; SnapEDA_Link: https://www.snapeda.com/parts/RCU-0C/TE%20Connectivity/view-part/4791537/?ref=snap; Supplier: Digi-Key
U3 = AP22615AWU-7: Integrated Circuit; Manufacturer: Diodes Inc.; Datasheet Link: https://www.diodes.com/assets/Datasheets/AP22815-615.pdf; Height: 1mm; Supplier: Digi-Key; Supplier Part Number: AP22615AWU-7DICT-ND; Arrow Part Number: AP22615AWU-7; Arrow Price/Stock: https://www.arrow.com/en/products/ap22615awu-7/diodes-incorporated; Manufacturer Part Number: AP22615AWU-7
U4 = MCP6411T-E_OT: IC OPAMP GP 1 CIRCUIT SOT23-5; Manufacturer: Microchip; Datasheet Link: http://ww1.microchip.com/downloads/en/DeviceDoc/20005791B.pdf; Height: 1.45mm; Manufacturer Part Number: MCP6411T-E/OT; Mouser Part Number: 579-MCP6411T-E/OT; Mouser Price/Stock: https://www.mouser.com/Search/Refine.aspx?Keyword=579-MCP6411T-E%2FOT; Arrow Part Number: MCP6411T-E/OT; Arrow Price/Stock: https://www.arrow.com/en/products/mcp6411t-eot/microchip-technology; Supplier: Digi-Key; Supplier Part Number: MCP6411T-E/OTCT-ND
U5-U8 = NX3L4051PW,118: 1 Circuit IC Switch 8:1 750mOhm 16-TSSOP; MF: NXP USA; Check_prices: https://www.snapeda.com/parts/NX3L4051PW,118/NXP%20USA%20Inc./view-part/648693/?ref=eda; SnapEDA_Link: https://www.snapeda.com/parts/NX3L4051PW,118/NXP%20USA%20Inc./view-part/648693/?ref=snap; Package: TSSOP-16 NXP USA; MP: NX3L4051PW,118; Value: *; Digi-Key_Part_Number: 568-12393-1-ND; Purchase-URL: https://pricing.snapeda.com/search/part/NX3L4051PW,118/?ref=eda

## Sheet SENSE_MUXES.SchDoc: =DocumentName
size C; SheetNumber: 5; SheetTotal: 8
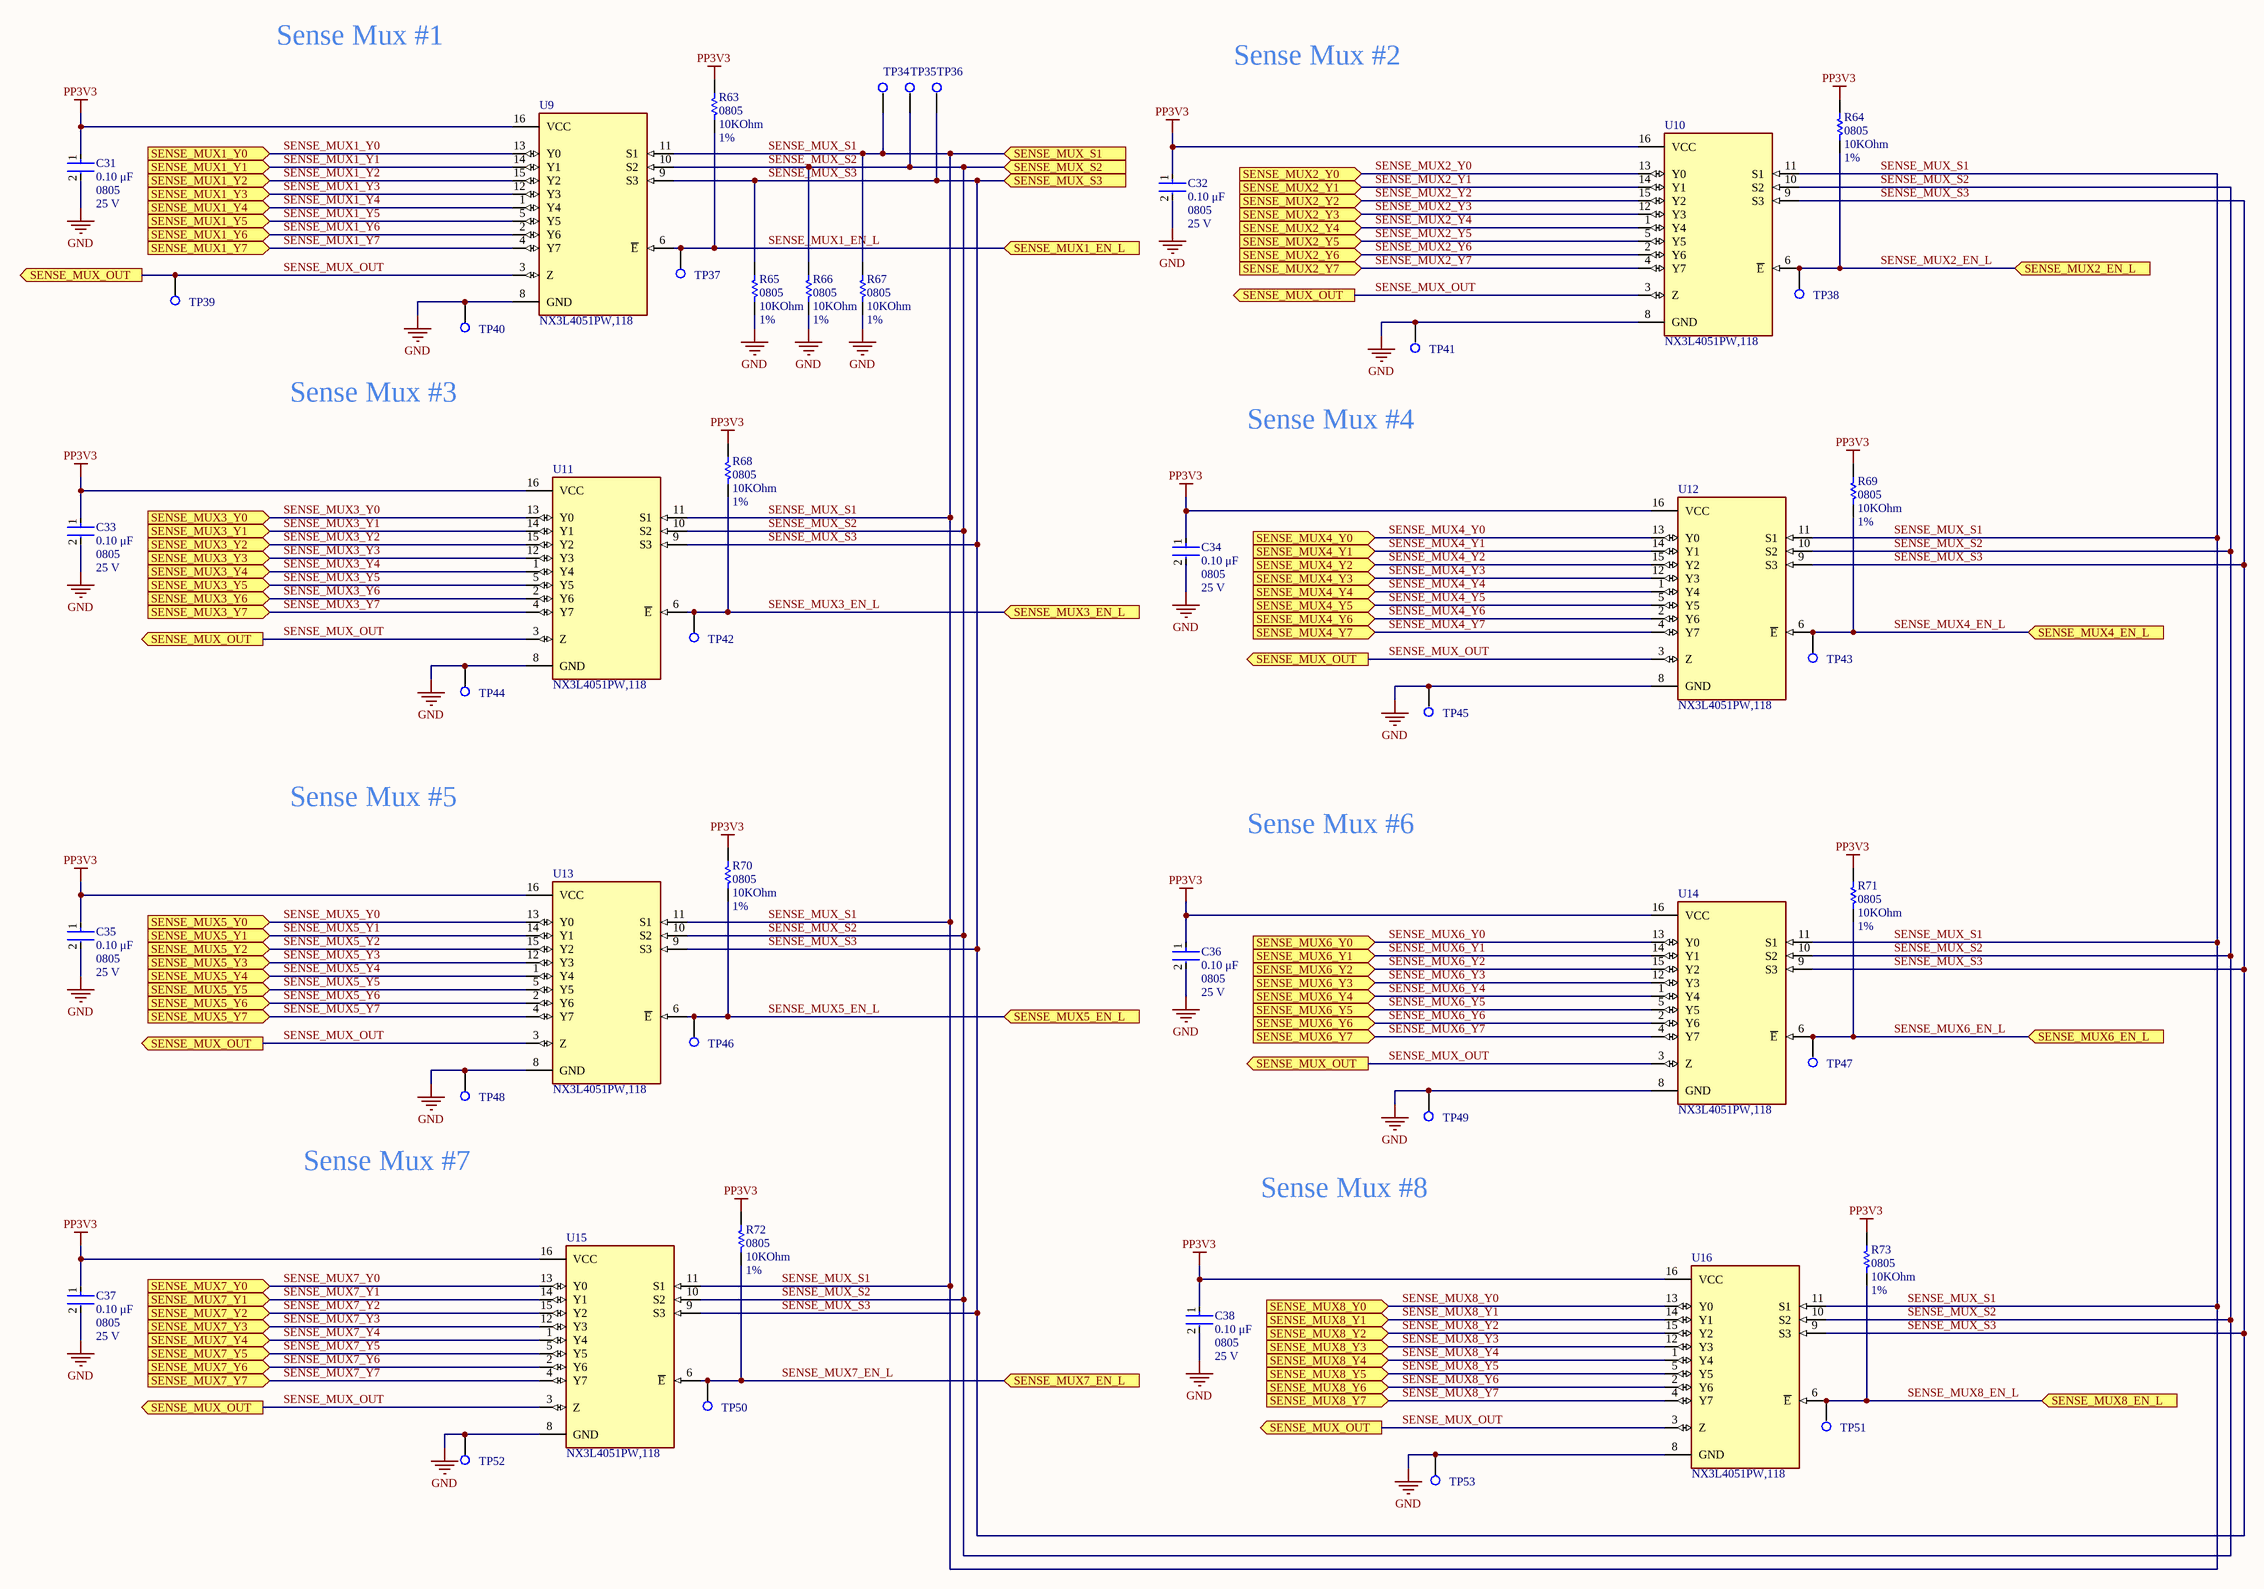
[diagram p4: SENSE_MUXES.SchDoc]

### Parts
(Parts that share a designator on the sheet are numbered #1, #2 ... from top to bottom, then left to right.)
C31  Capacitance: 0.10 μF  Package: 0805  Voltage Rating: 25 V  [FP-C0805C-DN-IPC_B]  (hidden comment: C0805C104M3RACTU)
C32  Capacitance: 0.10 μF  Package: 0805  Voltage Rating: 25 V  [FP-C0805C-DN-IPC_B]  (hidden comment: C0805C104M3RACTU)
C33  Capacitance: 0.10 μF  Package: 0805  Voltage Rating: 25 V  [FP-C0805C-DN-IPC_B]  (hidden comment: C0805C104M3RACTU)
C34  Capacitance: 0.10 μF  Package: 0805  Voltage Rating: 25 V  [FP-C0805C-DN-IPC_B]  (hidden comment: C0805C104M3RACTU)
C35#1  Capacitance: 0.10 μF  Package: 0805  Voltage Rating: 25 V  [FP-C0805C-DN-IPC_B]  (hidden comment: C0805C104M3RACTU)
C36#1  Capacitance: 0.10 μF  Package: 0805  Voltage Rating: 25 V  [FP-C0805C-DN-IPC_B]  (hidden comment: C0805C104M3RACTU)
C37#1  Capacitance: 0.10 μF  Package: 0805  Voltage Rating: 25 V  [FP-C0805C-DN-IPC_B]  (hidden comment: C0805C104M3RACTU)
C38#1  Capacitance: 0.10 μF  Package: 0805  Voltage Rating: 25 V  [FP-C0805C-DN-IPC_B]  (hidden comment: C0805C104M3RACTU)
R63  value 10KOhm  Package Reference: 0805  Tolerance: 1%  [RESC2013X50X30ML20T20]  (hidden comment: CRCW080515K0FKTA)
R64  value 10KOhm  Package Reference: 0805  Tolerance: 1%  [RESC2013X50X30ML20T20]  (hidden comment: CRCW080515K0FKTA)
R65  value 10KOhm  Package Reference: 0805  Tolerance: 1%  [RESC2013X50X30ML20T20]  (hidden comment: CRCW080515K0FKTA)
R66#2  value 10KOhm  Package Reference: 0805  Tolerance: 1%  [RESC2013X50X30ML20T20]  (hidden comment: CRCW080515K0FKTA)
R67#2  value 10KOhm  Package Reference: 0805  Tolerance: 1%  [RESC2013X50X30ML20T20]  (hidden comment: CRCW080515K0FKTA)
R68  value 10KOhm  Package Reference: 0805  Tolerance: 1%  [RESC2013X50X30ML20T20]  (hidden comment: CRCW080515K0FKTA)
R69  value 10KOhm  Package Reference: 0805  Tolerance: 1%  [RESC2013X50X30ML20T20]  (hidden comment: CRCW080515K0FKTA)
R70  value 10KOhm  Package Reference: 0805  Tolerance: 1%  [RESC2013X50X30ML20T20]  (hidden comment: CRCW080515K0FKTA)
R71  value 10KOhm  Package Reference: 0805  Tolerance: 1%  [RESC2013X50X30ML20T20]  (hidden comment: CRCW080515K0FKTA)
R72  value 10KOhm  Package Reference: 0805  Tolerance: 1%  [RESC2013X50X30ML20T20]  (hidden comment: CRCW080515K0FKTA)
R73  value 10KOhm  Package Reference: 0805  Tolerance: 1%  [RESC2013X50X30ML20T20]  (hidden comment: CRCW080515K0FKTA)
TP34  RCU-0C  [TP+195X110]  (value not drawn)
TP35  RCU-0C  [TP+195X110]  (value not drawn)
TP36  RCU-0C  [TP+195X110]  (value not drawn)
TP37  RCU-0C  [TP+195X110]  (value not drawn)
TP38  RCU-0C  [TP+195X110]  (value not drawn)
TP39  RCU-0C  [TP+195X110]  (value not drawn)
TP40  RCU-0C  [TP+195X110]  (value not drawn)
TP41  RCU-0C  [TP+195X110]  (value not drawn)
TP42  RCU-0C  [TP+195X110]  (value not drawn)
TP43  RCU-0C  [TP+195X110]  (value not drawn)
TP44  RCU-0C  [TP+195X110]  (value not drawn)
TP45  RCU-0C  [TP+195X110]  (value not drawn)
TP46  RCU-0C  [TP+195X110]  (value not drawn)
TP47  RCU-0C  [TP+195X110]  (value not drawn)
TP48  RCU-0C  [TP+195X110]  (value not drawn)
TP49  RCU-0C  [TP+195X110]  (value not drawn)
TP50  RCU-0C  [TP+195X110]  (value not drawn)
TP51  RCU-0C  [TP+195X110]  (value not drawn)
TP52  RCU-0C  [TP+195X110]  (value not drawn)
TP53  RCU-0C  [TP+195X110]  (value not drawn)
U9  NX3L4051PW,118  [SOP65P640X110-16N - duplicate]
U10  NX3L4051PW,118  [SOP65P640X110-16N - duplicate]
U11  NX3L4051PW,118  [SOP65P640X110-16N - duplicate]
U12  NX3L4051PW,118  [SOP65P640X110-16N - duplicate]
U13  NX3L4051PW,118  [SOP65P640X110-16N - duplicate]
U14  NX3L4051PW,118  [SOP65P640X110-16N - duplicate]
U15  NX3L4051PW,118  [SOP65P640X110-16N - duplicate]
U16  NX3L4051PW,118  [SOP65P640X110-16N - duplicate]

### Ports
SENSE_MUX1_EN_L (in), SENSE_MUX1_Y0 (in), SENSE_MUX1_Y1 (in), SENSE_MUX1_Y2 (in), SENSE_MUX1_Y3 (in), SENSE_MUX1_Y4 (in), SENSE_MUX1_Y5 (in), SENSE_MUX1_Y6 (in), SENSE_MUX1_Y7 (in), SENSE_MUX2_EN_L (in), SENSE_MUX2_Y0 (in), SENSE_MUX2_Y1 (in), SENSE_MUX2_Y2 (in), SENSE_MUX2_Y3 (in), SENSE_MUX2_Y4 (in), SENSE_MUX2_Y5 (in), SENSE_MUX2_Y6 (in), SENSE_MUX2_Y7 (in), SENSE_MUX3_EN_L (in), SENSE_MUX3_Y0 (in), SENSE_MUX3_Y1 (in), SENSE_MUX3_Y2 (in), SENSE_MUX3_Y3 (in), SENSE_MUX3_Y4 (in), SENSE_MUX3_Y5 (in), SENSE_MUX3_Y6 (in), SENSE_MUX3_Y7 (in), SENSE_MUX4_EN_L (in), SENSE_MUX4_Y0 (in), SENSE_MUX4_Y1 (in), SENSE_MUX4_Y2 (in), SENSE_MUX4_Y3 (in), SENSE_MUX4_Y4 (in), SENSE_MUX4_Y5 (in), SENSE_MUX4_Y6 (in), SENSE_MUX4_Y7 (in), SENSE_MUX5_EN_L (in), SENSE_MUX5_Y0 (in), SENSE_MUX5_Y1 (in), SENSE_MUX5_Y2 (in), SENSE_MUX5_Y3 (in), SENSE_MUX5_Y4 (in), SENSE_MUX5_Y5 (in), SENSE_MUX5_Y6 (in), SENSE_MUX5_Y7 (in), SENSE_MUX6_EN_L (in), SENSE_MUX6_Y0 (in), SENSE_MUX6_Y1 (in), SENSE_MUX6_Y2 (in), SENSE_MUX6_Y3 (in), SENSE_MUX6_Y4 (in), SENSE_MUX6_Y5 (in), SENSE_MUX6_Y6 (in), SENSE_MUX6_Y7 (in), SENSE_MUX7_EN_L (in), SENSE_MUX7_Y0 (in), SENSE_MUX7_Y1 (in), SENSE_MUX7_Y2 (in), SENSE_MUX7_Y3 (in), SENSE_MUX7_Y4 (in), SENSE_MUX7_Y5 (in), SENSE_MUX7_Y6 (in), SENSE_MUX7_Y7 (in), SENSE_MUX8_EN_L (in), SENSE_MUX8_Y0 (in), SENSE_MUX8_Y1 (in), SENSE_MUX8_Y2 (in), SENSE_MUX8_Y3 (in), SENSE_MUX8_Y4 (in), SENSE_MUX8_Y5 (in), SENSE_MUX8_Y6 (in), SENSE_MUX8_Y7 (in), SENSE_MUX_OUT (out), SENSE_MUX_S1 (in), SENSE_MUX_S2 (in), SENSE_MUX_S3 (in)

### Nets
GND: C31.2 C32.2 C33.2 C34.2 C35#1.2 C36#1.2 C37#1.2 C38#1.2 R65.1 R66#2.1 R67#2.1 TP40.1 TP41.1 TP44.1 TP45.1 TP48.1 TP49.1 TP52.1 TP53.1 U9.8(GND) U10.8(GND) U11.8(GND) U12.8(GND) U13.8(GND) U14.8(GND) U15.8(GND) U16.8(GND)
PP3V3: C31.1 C32.1 C33.1 C34.1 C35#1.1 C36#1.1 C37#1.1 C38#1.1 R63.2 R64.2 R68.2 R69.2 R70.2 R71.2 R72.2 R73.2 U9.16(VCC) U10.16(VCC) U11.16(VCC) U12.16(VCC) U13.16(VCC) U14.16(VCC) U15.16(VCC) U16.16(VCC)
SENSE_MUX1_EN_L: R63.1 TP37.1 U9.6(~{E}) ; port SENSE_MUX1_EN_L
SENSE_MUX1_Y0: U9.13(Y0) ; port SENSE_MUX1_Y0
SENSE_MUX1_Y1: U9.14(Y1) ; port SENSE_MUX1_Y1
SENSE_MUX1_Y2: U9.15(Y2) ; port SENSE_MUX1_Y2
SENSE_MUX1_Y3: U9.12(Y3) ; port SENSE_MUX1_Y3
SENSE_MUX1_Y4: U9.1(Y4) ; port SENSE_MUX1_Y4
SENSE_MUX1_Y5: U9.5(Y5) ; port SENSE_MUX1_Y5
SENSE_MUX1_Y6: U9.2(Y6) ; port SENSE_MUX1_Y6
SENSE_MUX1_Y7: U9.4(Y7) ; port SENSE_MUX1_Y7
SENSE_MUX2_EN_L: R64.1 TP38.1 U10.6(~{E}) ; port SENSE_MUX2_EN_L
SENSE_MUX2_Y0: U10.13(Y0) ; port SENSE_MUX2_Y0
SENSE_MUX2_Y1: U10.14(Y1) ; port SENSE_MUX2_Y1
SENSE_MUX2_Y2: U10.15(Y2) ; port SENSE_MUX2_Y2
SENSE_MUX2_Y3: U10.12(Y3) ; port SENSE_MUX2_Y3
SENSE_MUX2_Y4: U10.1(Y4) ; port SENSE_MUX2_Y4
SENSE_MUX2_Y5: U10.5(Y5) ; port SENSE_MUX2_Y5
SENSE_MUX2_Y6: U10.2(Y6) ; port SENSE_MUX2_Y6
SENSE_MUX2_Y7: U10.4(Y7) ; port SENSE_MUX2_Y7
SENSE_MUX3_EN_L: R68.1 TP42.1 U11.6(~{E}) ; port SENSE_MUX3_EN_L
SENSE_MUX3_Y0: U11.13(Y0) ; port SENSE_MUX3_Y0
SENSE_MUX3_Y1: U11.14(Y1) ; port SENSE_MUX3_Y1
SENSE_MUX3_Y2: U11.15(Y2) ; port SENSE_MUX3_Y2
SENSE_MUX3_Y3: U11.12(Y3) ; port SENSE_MUX3_Y3
SENSE_MUX3_Y4: U11.1(Y4) ; port SENSE_MUX3_Y4
SENSE_MUX3_Y5: U11.5(Y5) ; port SENSE_MUX3_Y5
SENSE_MUX3_Y6: U11.2(Y6) ; port SENSE_MUX3_Y6
SENSE_MUX3_Y7: U11.4(Y7) ; port SENSE_MUX3_Y7
SENSE_MUX4_EN_L: R69.1 TP43.1 U12.6(~{E}) ; port SENSE_MUX4_EN_L
SENSE_MUX4_Y0: U12.13(Y0) ; port SENSE_MUX4_Y0
SENSE_MUX4_Y1: U12.14(Y1) ; port SENSE_MUX4_Y1
SENSE_MUX4_Y2: U12.15(Y2) ; port SENSE_MUX4_Y2
SENSE_MUX4_Y3: U12.12(Y3) ; port SENSE_MUX4_Y3
SENSE_MUX4_Y4: U12.1(Y4) ; port SENSE_MUX4_Y4
SENSE_MUX4_Y5: U12.5(Y5) ; port SENSE_MUX4_Y5
SENSE_MUX4_Y6: U12.2(Y6) ; port SENSE_MUX4_Y6
SENSE_MUX4_Y7: U12.4(Y7) ; port SENSE_MUX4_Y7
SENSE_MUX5_EN_L: R70.1 TP46.1 U13.6(~{E}) ; port SENSE_MUX5_EN_L
SENSE_MUX5_Y0: U13.13(Y0) ; port SENSE_MUX5_Y0
SENSE_MUX5_Y1: U13.14(Y1) ; port SENSE_MUX5_Y1
SENSE_MUX5_Y2: U13.15(Y2) ; port SENSE_MUX5_Y2
SENSE_MUX5_Y3: U13.12(Y3) ; port SENSE_MUX5_Y3
SENSE_MUX5_Y4: U13.1(Y4) ; port SENSE_MUX5_Y4
SENSE_MUX5_Y5: U13.5(Y5) ; port SENSE_MUX5_Y5
SENSE_MUX5_Y6: U13.2(Y6) ; port SENSE_MUX5_Y6
SENSE_MUX5_Y7: U13.4(Y7) ; port SENSE_MUX5_Y7
SENSE_MUX6_EN_L: R71.1 TP47.1 U14.6(~{E}) ; port SENSE_MUX6_EN_L
SENSE_MUX6_Y0: U14.13(Y0) ; port SENSE_MUX6_Y0
SENSE_MUX6_Y1: U14.14(Y1) ; port SENSE_MUX6_Y1
SENSE_MUX6_Y2: U14.15(Y2) ; port SENSE_MUX6_Y2
SENSE_MUX6_Y3: U14.12(Y3) ; port SENSE_MUX6_Y3
SENSE_MUX6_Y4: U14.1(Y4) ; port SENSE_MUX6_Y4
SENSE_MUX6_Y5: U14.5(Y5) ; port SENSE_MUX6_Y5
SENSE_MUX6_Y6: U14.2(Y6) ; port SENSE_MUX6_Y6
SENSE_MUX6_Y7: U14.4(Y7) ; port SENSE_MUX6_Y7
SENSE_MUX7_EN_L: R72.1 TP50.1 U15.6(~{E}) ; port SENSE_MUX7_EN_L
SENSE_MUX7_Y0: U15.13(Y0) ; port SENSE_MUX7_Y0
SENSE_MUX7_Y1: U15.14(Y1) ; port SENSE_MUX7_Y1
SENSE_MUX7_Y2: U15.15(Y2) ; port SENSE_MUX7_Y2
SENSE_MUX7_Y3: U15.12(Y3) ; port SENSE_MUX7_Y3
SENSE_MUX7_Y4: U15.1(Y4) ; port SENSE_MUX7_Y4
SENSE_MUX7_Y5: U15.5(Y5) ; port SENSE_MUX7_Y5
SENSE_MUX7_Y6: U15.2(Y6) ; port SENSE_MUX7_Y6
SENSE_MUX7_Y7: U15.4(Y7) ; port SENSE_MUX7_Y7
SENSE_MUX8_EN_L: R73.1 TP51.1 U16.6(~{E}) ; port SENSE_MUX8_EN_L
SENSE_MUX8_Y0: U16.13(Y0) ; port SENSE_MUX8_Y0
SENSE_MUX8_Y1: U16.14(Y1) ; port SENSE_MUX8_Y1
SENSE_MUX8_Y2: U16.15(Y2) ; port SENSE_MUX8_Y2
SENSE_MUX8_Y3: U16.12(Y3) ; port SENSE_MUX8_Y3
SENSE_MUX8_Y4: U16.1(Y4) ; port SENSE_MUX8_Y4
SENSE_MUX8_Y5: U16.5(Y5) ; port SENSE_MUX8_Y5
SENSE_MUX8_Y6: U16.2(Y6) ; port SENSE_MUX8_Y6
SENSE_MUX8_Y7: U16.4(Y7) ; port SENSE_MUX8_Y7
SENSE_MUX_OUT: TP39.1 U9.3(Z) U10.3(Z) U11.3(Z) U12.3(Z) U13.3(Z) U14.3(Z) U15.3(Z) U16.3(Z) ; port SENSE_MUX_OUT
SENSE_MUX_S1: R67#2.2 TP34.1 U9.11(S1) U10.11(S1) U11.11(S1) U12.11(S1) U13.11(S1) U14.11(S1) U15.11(S1) U16.11(S1) ; port SENSE_MUX_S1
SENSE_MUX_S2: R66#2.2 TP35.1 U9.10(S2) U10.10(S2) U11.10(S2) U12.10(S2) U13.10(S2) U14.10(S2) U15.10(S2) U16.10(S2) ; port SENSE_MUX_S2
SENSE_MUX_S3: R65.2 TP36.1 U9.9(S3) U10.9(S3) U11.9(S3) U12.9(S3) U13.9(S3) U14.9(S3) U15.9(S3) U16.9(S3) ; port SENSE_MUX_S3

### Notes on the sheet
- Sense Mux #1
- Sense Mux #2
- Sense Mux #3
- Sense Mux #4
- Sense Mux #5
- Sense Mux #6
- Sense Mux #7
- Sense Mux #8
- Title
- Size:
- Date:
- File:
- C
- Number:
- Time:
- Revision:
- Sheet
- of

### Library data of the parts
C31-C34 C35#1 C36#1 C37#1 C38#1 = CMP-2007-00282-2: as C18 on sheet SD_CARD_WiFi; Digikey Description: CAP CER 0.1UF 25V 20% X7R 0805; Device Class L2: Capacitors; Temperature: -55°C to +125°C; Device Class L1: Passive Components; ComponentLink2Description: Datasheet; Mouser Description: Multilayer Ceramic Capacitors MLCC - SMD/SMT 25volts 0.1uF X7R 20%; Temperature Range High: +125°C; Device Class L3: Ceramic Capacitors; Automotive: No; Temperature Range Low: -55°C; RoHS: TRUE; Category: Cap; Lead Free: Yes; Ipc Land Pattern Name: CAPC200125X78; Height: 0.88mm; Temperature Characteristic: X7R; Octopart: https://octopart.com/c0805c104m3ractu-kemet-9138612; ComponentLink2URL: https://content.kemet.com/datasheets/KEM_C1003_C0G_SMD.pdf; Manufacturer Part Number: C0805C104M3RACTU; Supplier: Digi-Key; Supplier Part Number: 399-C0805C104M3RAC7800CT-ND
R63-R65 R66#2 R67#2 R68-R73 = CMP-2001-04968-1: Manufacturer: Vishay Dale; Manufacturer Part Number: CRCW080515K0FKTA; Supplier: Digi-Key; Supplier Part Number: 541-3019-1-ND
TP34-TP53 = RCU-0C: as TP14 on sheet SD_CARD_WiFi; Value: *; Package: SON-6 TE Connectivity AMP Connectors; Purchase-URL: https://pricing.snapeda.com/search/part/RCU-0C/?ref=eda; Supplier Part Number: A106145CT-ND; Check_prices: https://www.snapeda.com/parts/RCU-0C/TE%20Connectivity/view-part/4791537/?ref=eda; Manufacturer Part Number: RCU-0C; SnapEDA_Link: https://www.snapeda.com/parts/RCU-0C/TE%20Connectivity/view-part/4791537/?ref=snap; Supplier: Digi-Key
U9-U16 = NX3L4051PW,118: 1 Circuit IC Switch 8:1 750mOhm 16-TSSOP; Manufacturer: NXP USA Inc.; MF: NXP USA; Check_prices: https://www.snapeda.com/parts/NX3L4051PW,118/NXP%20USA%20Inc./view-part/648693/?ref=eda; SnapEDA_Link: https://www.snapeda.com/parts/NX3L4051PW,118/NXP%20USA%20Inc./view-part/648693/?ref=snap; Package: TSSOP-16 NXP USA; MP: NX3L4051PW,118; Value: *; Digi-Key_Part_Number: 568-12393-1-ND; Purchase-URL: https://pricing.snapeda.com/search/part/NX3L4051PW,118/?ref=eda; Manufacturer Part Number: NX3L4051PW,118; Supplier: Digi-Key; Supplier Part Number: 568-12393-1-ND